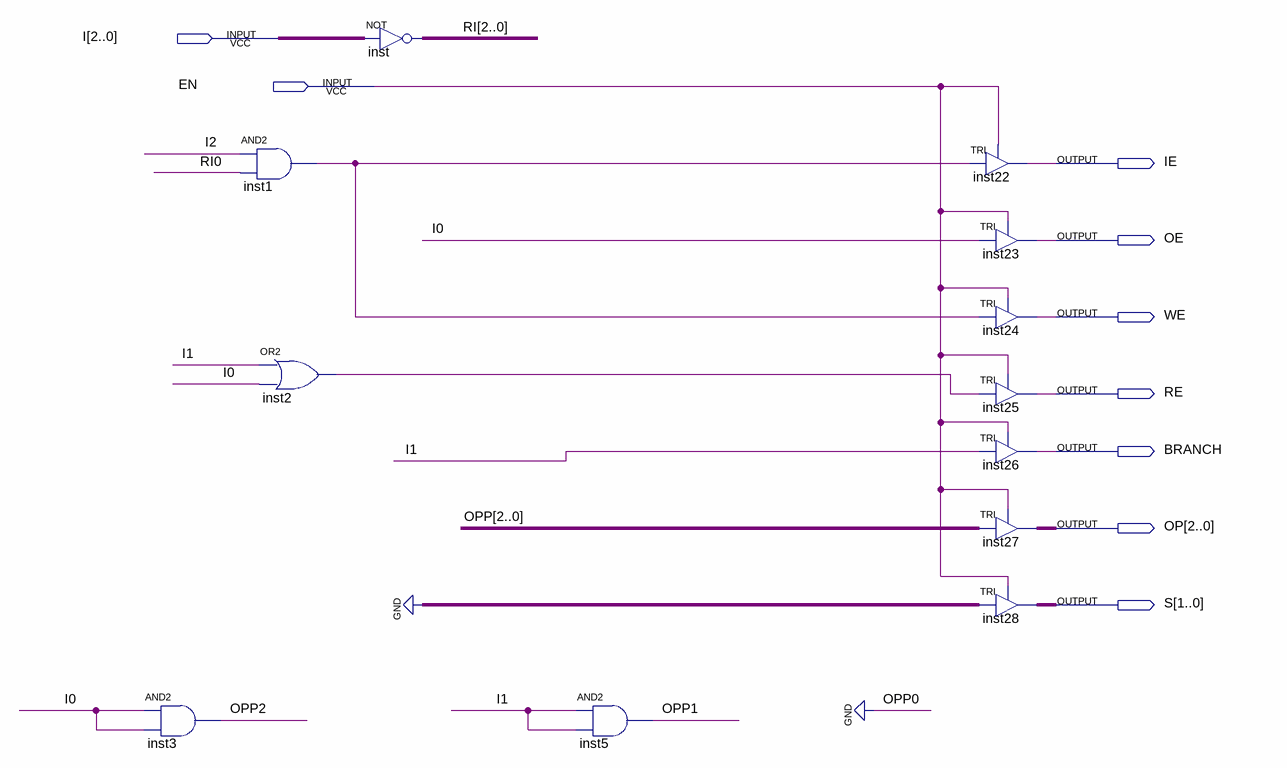
[diagram p0: schematic sheet]
// Quartus schematic LENHMORONG.bdf as structural Verilog: 12 symbols, 9 pins
module LENHMORONG (
  input  [2:0] I,
  input  EN,
  output IE,
  output OE,
  output WE,
  output RE,
  output BRANCH,
  output [2:0] OP,
  output [1:0] S
);

  wire inst1_out, inst2_out;
  wire [2:0] RI;
  wire [2:1] OPP;

  and inst3 (OPP[2], I[0], I[0]);
  and inst1 (inst1_out, I[2], RI[0]);
  or inst2 (inst2_out, I[1], I[0]);
  assign RI = ~I;  // NOT inst, 3 bits wide
  and inst5 (OPP[1], I[1], I[1]);
  TRI inst22 (.IN(inst1_out), .OE(EN), .OUT(IE));
  TRI inst23 (.IN(I[0]), .OE(EN), .OUT(OE));
  TRI inst24 (.IN(inst1_out), .OE(EN), .OUT(WE));
  TRI inst25 (.IN(inst2_out), .OE(EN), .OUT(RE));
  TRI inst26 (.IN(I[1]), .OE(EN), .OUT(BRANCH));
  TRI inst27[2:0] (.IN({OPP, 1'b0}), .OE(EN), .OUT(OP));
  TRI inst28[1:0] (.IN(2'b00), .OE(EN), .OUT(S));
endmodule
